# Altium schematic sheet CPLD.SchDoc
size A3; SheetNumber: 13; SheetTotal: 16
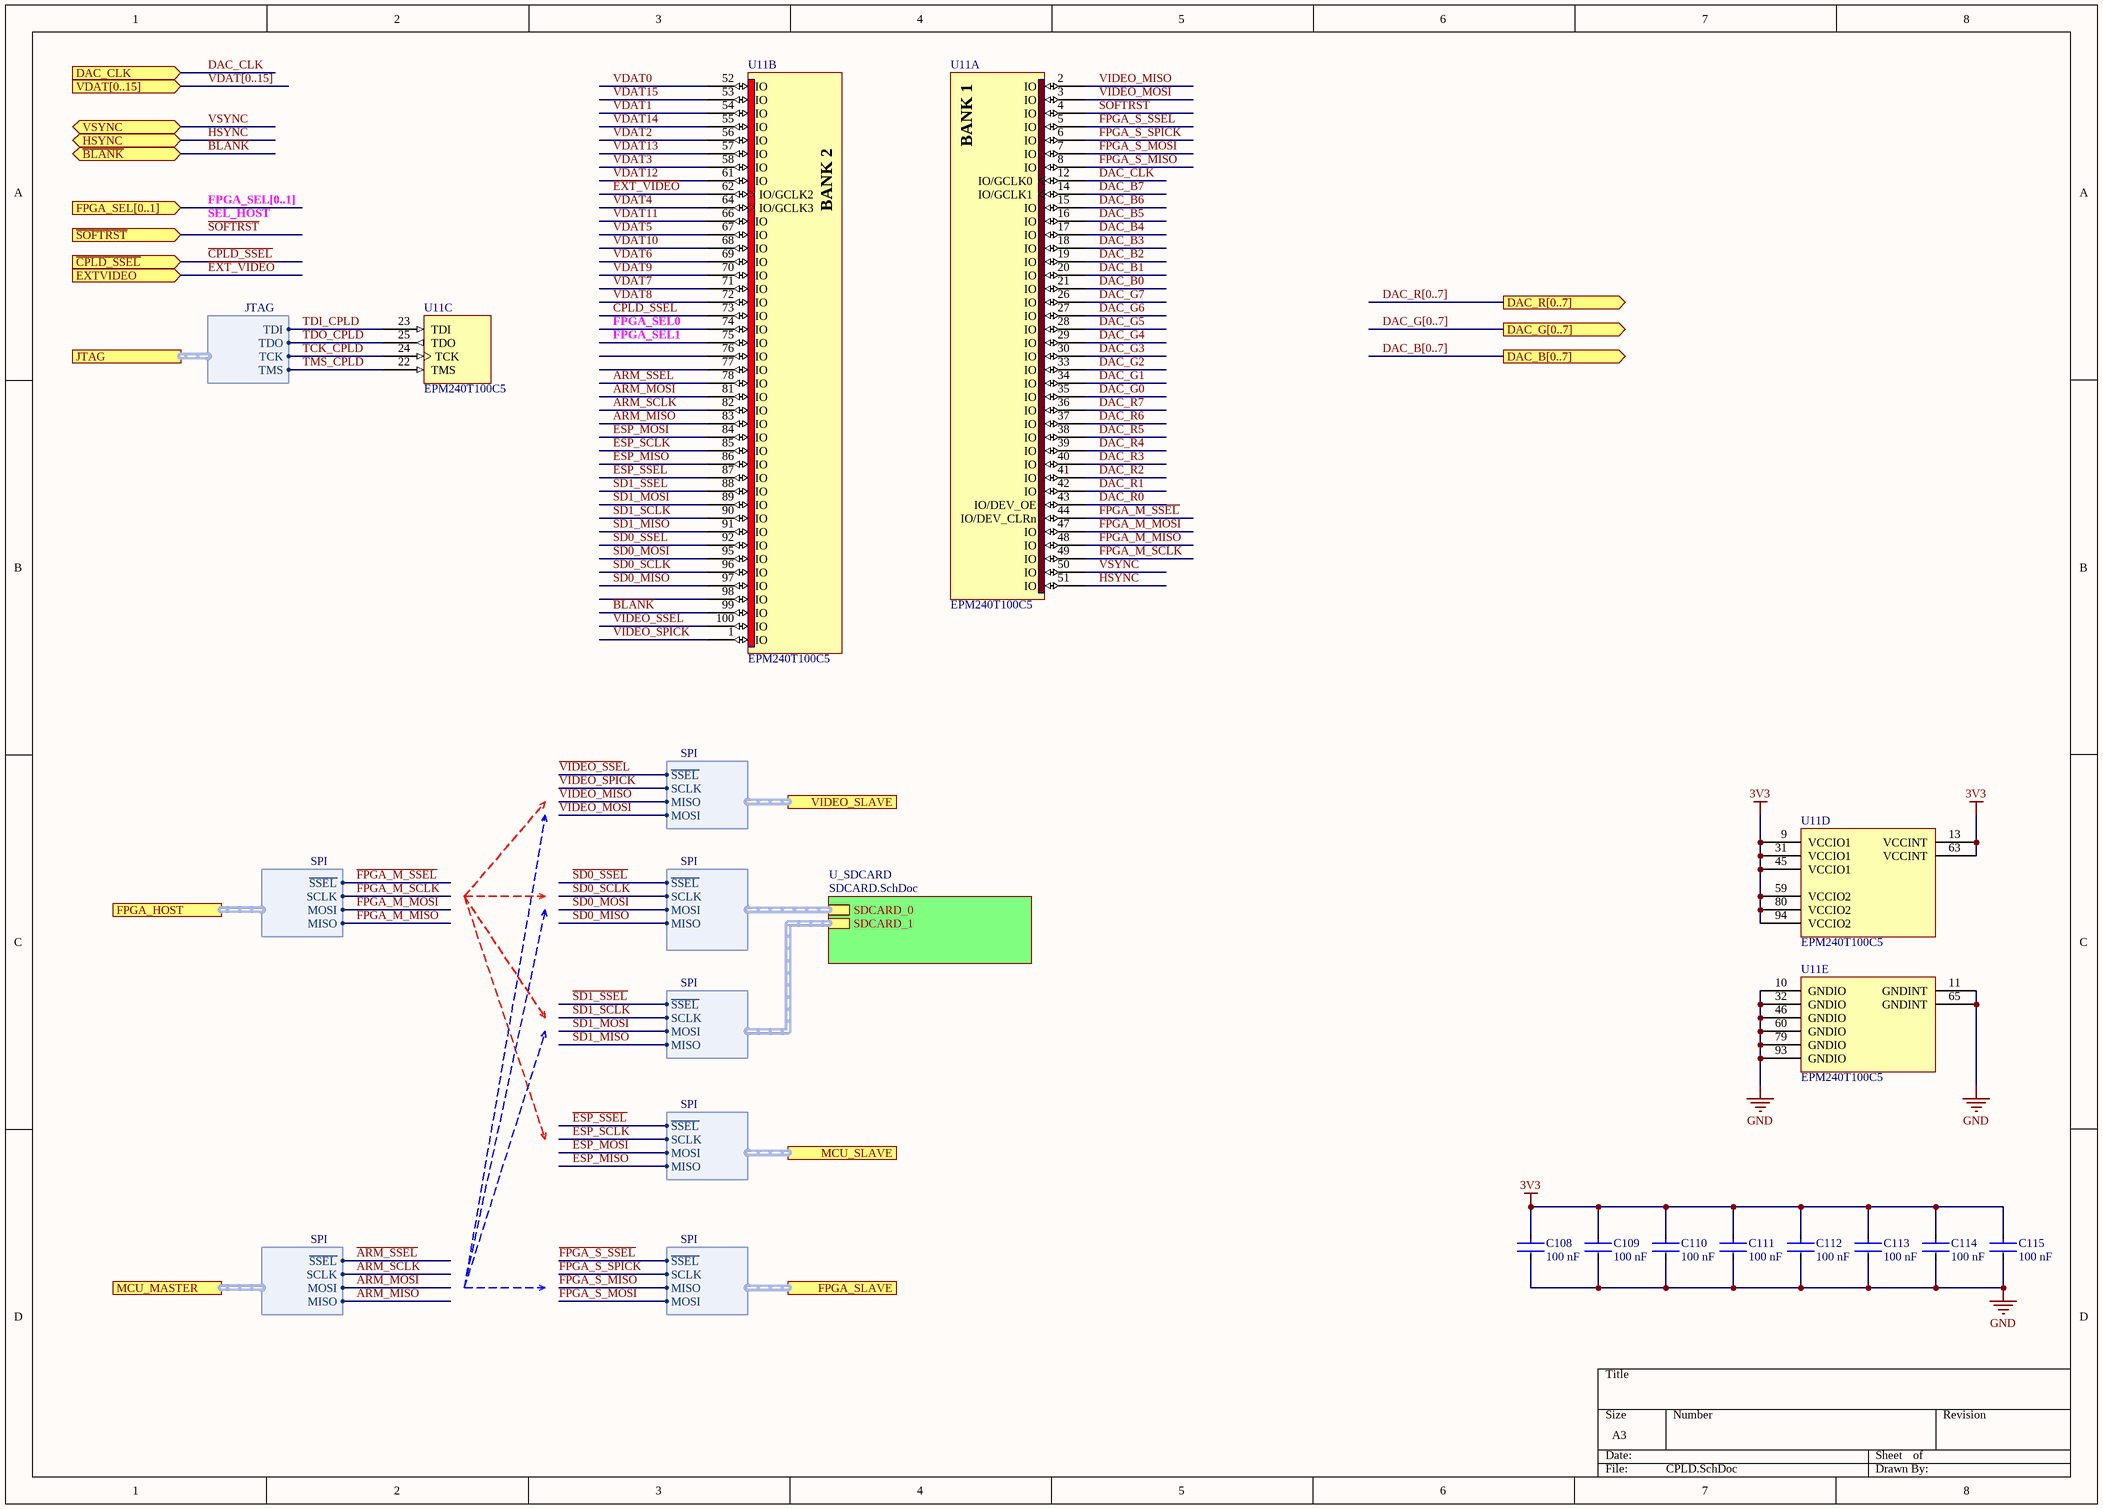
[diagram p0: CPLD.SchDoc]

## Parts
C108  Capacitance: 100 nF  [CC0805]  (hidden comment: CC0805-1.5pF)
C109  Capacitance: 100 nF  [CC0805]  (hidden comment: CC0805-1.5pF)
C110  Capacitance: 100 nF  [CC0805]  (hidden comment: CC0805-1.5pF)
C111  Capacitance: 100 nF  [CC0805]  (hidden comment: CC0805-1.5pF)
C112  Capacitance: 100 nF  [CC0805]  (hidden comment: CC0805-1.5pF)
C113  Capacitance: 100 nF  [CC0805]  (hidden comment: CC0805-1.5pF)
C114  Capacitance: 100 nF  [CC0805]  (hidden comment: CC0805-1.5pF)
C115  Capacitance: 100 nF  [CC0805]  (hidden comment: CC0805-1.5pF)
U11  EPM240T100C5  [TQFP100_M]  (parts A,B,C,D,E of 5)

## Sub-sheets
U_SDCARD = SDCARD.SchDoc: SDCARD_0 (harness SPI), SDCARD_1 (harness SPI)

## Ports
DAC_B[0..7] (out), DAC_CLK (in), DAC_G[0..7] (out), DAC_R[0..7] (out), EXTVIDEO (in), FPGA_HOST (harness SPI), FPGA_SEL[0..1] (in), FPGA_SLAVE (harness SPI), HSYNC (bidir), JTAG (harness JTAG), MCU_MASTER (harness SPI), MCU_SLAVE (harness SPI), VDAT[0..15] (in), VIDEO_SLAVE (harness SPI), VSYNC (bidir), ~{BLANK} (bidir), ~{CPLD_SSEL} (in), ~{SOFTRST} (in)

## Harnesses
SPI: ~{SSEL}, SCLK, MOSI, MISO
JTAG: TCK, TDO, TDI, TMS

## Nets
3V3: C108.1 C109.1 C110.1 C111.1 C112.1 C113.1 C114.1 C115.1 U11.9(VCCIO1) U11.13(VCCINT) U11.31(VCCIO1) U11.45(VCCIO1) U11.59(VCCIO2) U11.63(VCCINT) U11.80(VCCIO2) U11.94(VCCIO2)
GND: C108.2 C109.2 C110.2 C111.2 C112.2 C113.2 C114.2 C115.2 U11.10(GNDIO) U11.11(GNDINT) U11.32(GNDIO) U11.46(GNDIO) U11.60(GNDIO) U11.65(GNDINT) U11.79(GNDIO) U11.93(GNDIO)
~{ARM_SSEL}: U11.78(IO) ; port MCU_MASTER.~{SSEL}
ARM_MISO: U11.83(IO) ; port MCU_MASTER.MISO
ARM_MOSI: U11.81(IO) ; port MCU_MASTER.MOSI
ARM_SCLK: U11.82(IO) ; port MCU_MASTER.SCLK
~{BLANK}: U11.99(IO) ; port ~{BLANK}
~{CPLD_SSEL}: U11.73(IO) ; port ~{CPLD_SSEL}
DAC_B0: U11.21(IO)
DAC_B1: U11.20(IO)
DAC_B2: U11.19(IO)
DAC_B3: U11.18(IO)
DAC_B4: U11.17(IO)
DAC_B5: U11.16(IO)
DAC_B6: U11.15(IO)
DAC_B7: U11.14(IO/GCLK1)
DAC_CLK: U11.12(IO/GCLK0) ; port DAC_CLK
DAC_G0: U11.35(IO)
DAC_G1: U11.34(IO)
DAC_G2: U11.33(IO)
DAC_G3: U11.30(IO)
DAC_G4: U11.29(IO)
DAC_G5: U11.28(IO)
DAC_G6: U11.27(IO)
DAC_G7: U11.26(IO)
DAC_R0: U11.43(IO/DEV_OE)
DAC_R1: U11.42(IO)
DAC_R2: U11.41(IO)
DAC_R3: U11.40(IO)
DAC_R4: U11.39(IO)
DAC_R5: U11.38(IO)
DAC_R6: U11.37(IO)
DAC_R7: U11.36(IO)
~{ESP_SSEL}: U11.87(IO) ; port MCU_SLAVE.~{SSEL}
~{EXT_VIDEO}: U11.62(IO/GCLK2) ; port EXTVIDEO
ESP_MISO: U11.86(IO) ; port MCU_SLAVE.MISO
ESP_MOSI: U11.84(IO) ; port MCU_SLAVE.MOSI
ESP_SCLK: U11.85(IO) ; port MCU_SLAVE.SCLK
~{FPGA_M_}~{SSEL}: U11.44(IO/DEV_CLRn) ; port FPGA_HOST.~{SSEL}
~{FPGA_S_SSEL}: U11.5(IO) ; port FPGA_SLAVE.~{SSEL}
FPGA_M_MISO: U11.48(IO) ; port FPGA_HOST.MISO
FPGA_M_MOSI: U11.47(IO) ; port FPGA_HOST.MOSI
FPGA_M_SCLK: U11.49(IO) ; port FPGA_HOST.SCLK
FPGA_S_MISO: U11.8(IO) ; port FPGA_SLAVE.MISO
FPGA_S_MOSI: U11.7(IO) ; port FPGA_SLAVE.MOSI
FPGA_S_SPICK: U11.6(IO) ; port FPGA_SLAVE.SCLK
FPGA_SEL0: U11.74(IO)
FPGA_SEL1: U11.75(IO)
HSYNC: U11.51(IO) ; port HSYNC
~{SD0_SSEL}: U11.92(IO) ; sheet U_SDCARD/SDCARD_0.~{SSEL}
~{SD1_SSEL}: U11.88(IO) ; sheet U_SDCARD/SDCARD_1.~{SSEL}
~{SOFTRST}: U11.4(IO) ; port ~{SOFTRST}
SD0_MISO: U11.97(IO) ; sheet U_SDCARD/SDCARD_0.MISO
SD0_MOSI: U11.95(IO) ; sheet U_SDCARD/SDCARD_0.MOSI
SD0_SCLK: U11.96(IO) ; sheet U_SDCARD/SDCARD_0.SCLK
SD1_MISO: U11.91(IO) ; sheet U_SDCARD/SDCARD_1.MISO
SD1_MOSI: U11.89(IO) ; sheet U_SDCARD/SDCARD_1.MOSI
SD1_SCLK: U11.90(IO) ; sheet U_SDCARD/SDCARD_1.SCLK
TCK_CPLD: U11.24(TCK) ; port JTAG.TCK
TDI_CPLD: U11.23(TDI) ; port JTAG.TDI
TDO_CPLD: U11.25(TDO) ; port JTAG.TDO
TMS_CPLD: U11.22(TMS) ; port JTAG.TMS
~{VIDEO_SSE}L: U11.100(IO) ; port VIDEO_SLAVE.~{SSEL}
VDAT0: U11.52(IO)
VDAT1: U11.54(IO)
VDAT2: U11.56(IO)
VDAT3: U11.58(IO)
VDAT4: U11.64(IO/GCLK3)
VDAT5: U11.67(IO)
VDAT6: U11.69(IO)
VDAT7: U11.71(IO)
VDAT8: U11.72(IO)
VDAT9: U11.70(IO)
VDAT10: U11.68(IO)
VDAT11: U11.66(IO)
VDAT12: U11.61(IO)
VDAT13: U11.57(IO)
VDAT14: U11.55(IO)
VDAT15: U11.53(IO)
VIDEO_MISO: U11.2(IO) ; port VIDEO_SLAVE.MISO
VIDEO_MOSI: U11.3(IO) ; port VIDEO_SLAVE.MOSI
VIDEO_SPICK: U11.1(IO) ; port VIDEO_SLAVE.SCLK
VSYNC: U11.50(IO) ; port VSYNC

Not connected (* = marked no-connect by the designer): U11 76(IO) 77(IO) 98(IO)

## Buses and harness runs
bus DAC_B[0..7] = port DAC_B[0..7]
bus DAC_G[0..7] = port DAC_G[0..7]
bus DAC_R[0..7] = port DAC_R[0..7]
bus FPGA_SEL[0..1] = port FPGA_SEL[0..1]
bus VDAT[0..15] = port VDAT[0..15]

## Notes on the sheet
- Labels drawn without touching a wire or pin: SEL_HOST
- (in symbol EPM240T100C5, part A) BANK 1
- (in symbol EPM240T100C5, part B) BANK 2

## Library data of the parts
C108-C115 = CC0805: CL21 Series 0805 1.5pF 50V ±0.25pF Tolerance C0G Multilayer Ceramic Chip Capacitor; Manufacturer Part Number: CL21C1R5CBANNNC; Manufacturer: Samsung; Category: Cap; value: 1.5pF; Case/Package: 0805
U11 = EPM240T100C5: MAX II 3.3/2.5V CPLD, 80 IOs, 240 Logic Elements, 100-Pin Plastic TQFP, Commercial Temperature, Speed Grade 5; Manufacturer: Intel Altera; PackageDescription: 100-Pin Plastic Thin Quad Flat Pack (TQFP100) - Wire Bond; Manufacturer Part Number: EPM240T100C5; value: EPM240T100C5; Case/Package: TQFP-100; Category: IC